# EAGLE schematic MUA08A.pac (EAGLE 7.5.0)

## Sheet 1 of 4: 0.8-14V to 5V converter
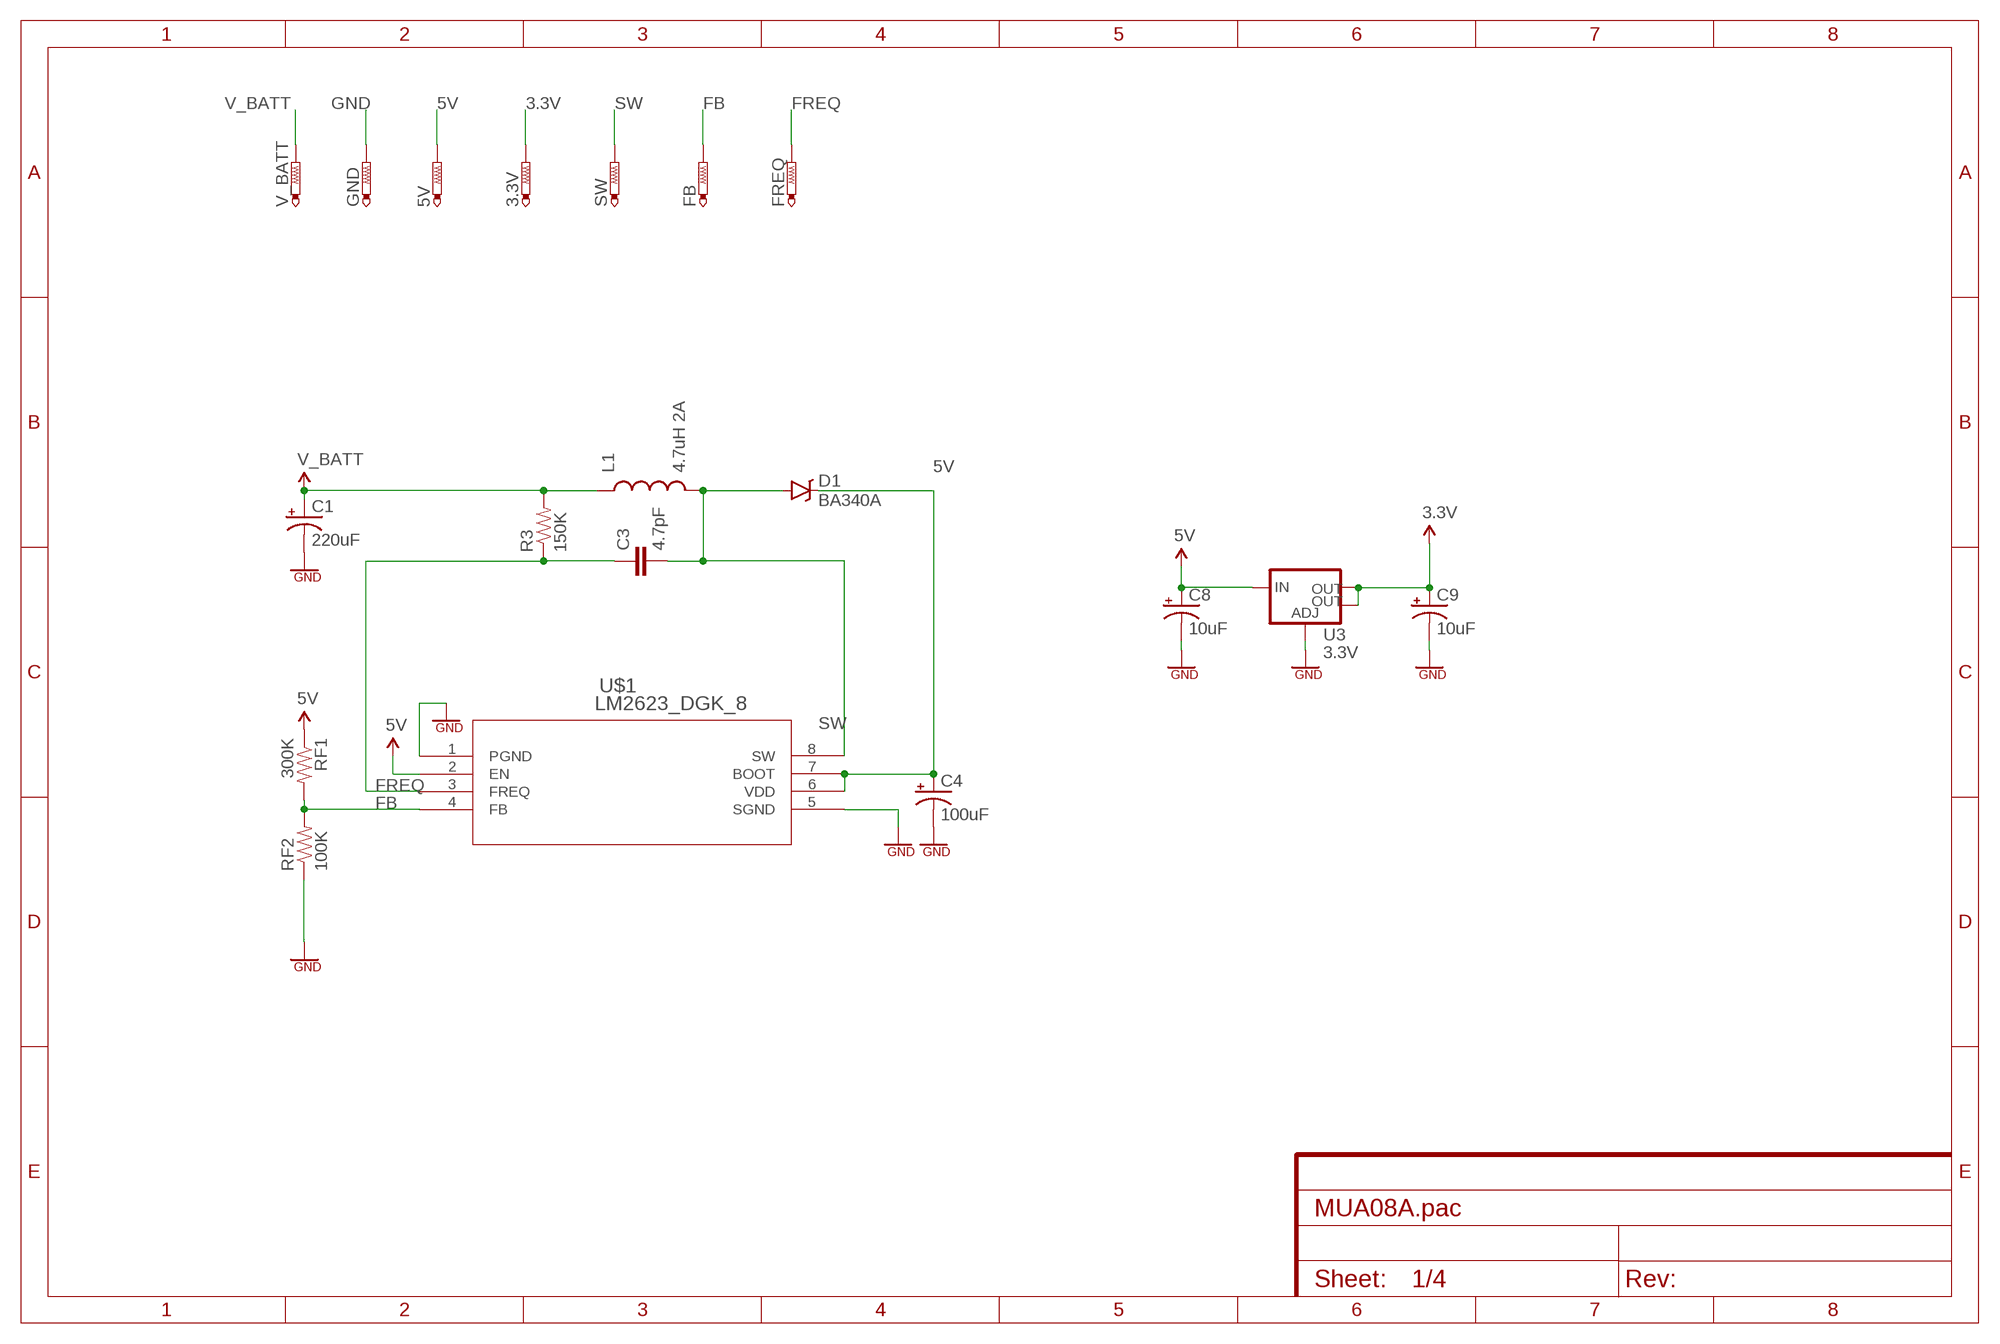
[diagram p0: schematic, sheet 1]
FRAME1 (FRAME-A4L): CNAME: Christmas Decoration Prototype; CREVISION: 0.1

### Parts
3.3V  PTR1PAD1-13  [P1-13]
5V  PTR1PAD1-13  [P1-13]
C1  220uF  CAP_POL1206-KIT  [EIA3216-KIT]
C3  4.7pF  CAP0603-CAP  [0603-CAP]
C4  100uF  CPOL-USB/3528-21R  [B/3528-21R]
C8  10uF  CAP_POL1206  [EIA3216]
C9  10uF  CAP_POL1206  [EIA3216]
D1  BA340A  B340A  [SMA-DIODE]
FB  PTR1PAD1-13  [P1-13]
FREQ  PTR1PAD1-13  [P1-13]
GND  PTR1PAD1-13  [P1-13]
L1  4.7uH 2A  INDUCTORCR54-KIT  [CR54-KIT]
R3  150K  RESISTOR0603-RES  [0603-RES]
RF1  300K  RESISTOR0603-RES  [0603-RES]
RF2  100K  RESISTOR0603-RES  [0603-RES]
SW  PTR1PAD1-13  [P1-13]
U3  3.3V  V_REG_LM1117SOT223  [SOT223]
U$1  LM2623_DGK_8  [MUA08A]
V_BATT  PTR1PAD1-13  [P1-13]

### Nets
3.3V: 3.3V.TP C9.A(+) U3.2(OUT) U3.4(OUT) ; also sheet 4
5V [POWER]: 5V.TP C4.+ C8.A(+) D1.C RF1.1 U3.3(IN) U$1.2(EN) U$1.6(VDD) U$1.7(BOOT) ; also sheet 2,3,4
FB: FB.TP RF1.2 RF2.2 U$1.4(FB)
FREQ: C3.1 FREQ.TP R3.1 U$1.3(FREQ)
GND [POWER]: C1.C(-) C4.- C8.C(-) C9.C(-) GND.TP RF2.1 U3.1(ADJ) U$1.1(PGND) U$1.5(SGND) ; also sheet 2,3,4
SW [POWER]: C3.2 D1.A L1.P$2 SW.TP U$1.8(SW)
V_BATT [POWER]: C1.A(+) L1.P$1 R3.2 V_BATT.TP

## Sheet 2 of 4: APA102-5050 RGB LED Chain
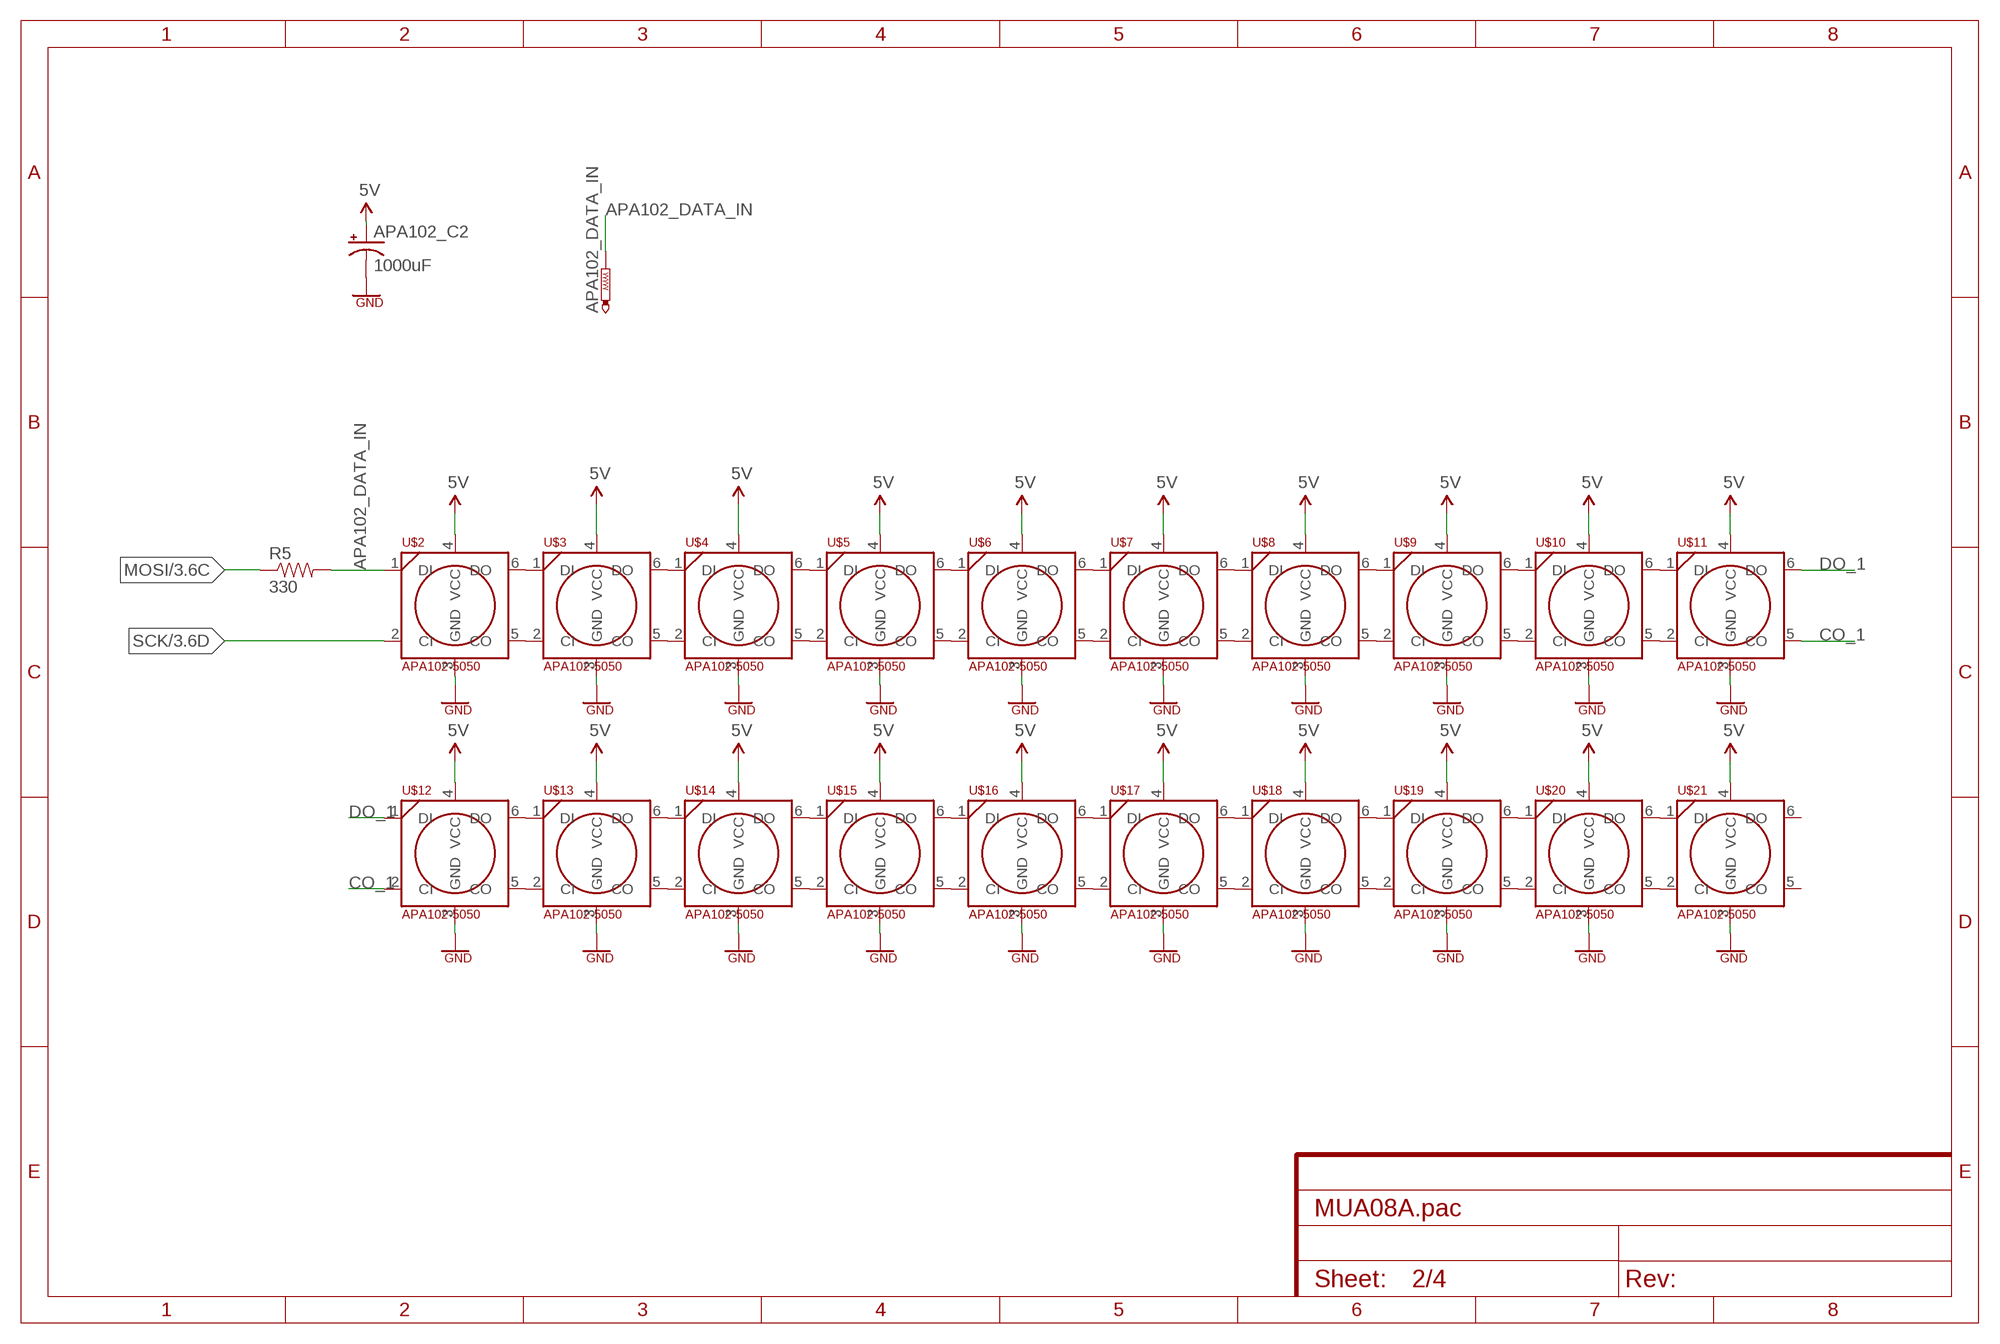
[diagram p1: schematic, sheet 2]
FRAME2 (FRAME-A4L): CNAME: APA102C RGB LEDs

### Parts
APA102_C2  1000uF  CPOL-USD/7343-31W  [D/7343-31W]
APA102_DATA_IN  PTR1PAD1-13  [P1-13]
R5  330  RESISTOR0603-RES  [0603-RES]
U$2  APA102-5050  [5050]
U$3  APA102-5050  [5050]
U$4  APA102-5050  [5050]
U$5  APA102-5050  [5050]
U$6  APA102-5050  [5050]
U$7  APA102-5050  [5050]
U$8  APA102-5050  [5050]
U$9  APA102-5050  [5050]
U$10  APA102-5050  [5050]
U$11  APA102-5050  [5050]
U$12  APA102-5050  [5050]
U$13  APA102-5050  [5050]
U$14  APA102-5050  [5050]
U$15  APA102-5050  [5050]
U$16  APA102-5050  [5050]
U$17  APA102-5050  [5050]
U$18  APA102-5050  [5050]
U$19  APA102-5050  [5050]
U$20  APA102-5050  [5050]
U$21  APA102-5050  [5050]

### Nets
5V [POWER]: APA102_C2.+ U$2.4(VCC) U$3.4(VCC) U$4.4(VCC) U$5.4(VCC) U$6.4(VCC) U$7.4(VCC) U$8.4(VCC) U$9.4(VCC) U$10.4(VCC) U$11.4(VCC) U$12.4(VCC) U$13.4(VCC) U$14.4(VCC) U$15.4(VCC) U$16.4(VCC) U$17.4(VCC) U$18.4(VCC) U$19.4(VCC) U$20.4(VCC) U$21.4(VCC) ; also sheet 1,3,4
APA102_DATA_IN: APA102_DATA_IN.TP R5.2 U$2.1(DI)
CO_1: U$11.5(CO) U$12.2(CI)
DO_1: U$11.6(DO) U$12.1(DI)
GND [POWER]: APA102_C2.- U$2.3(GND) U$3.3(GND) U$4.3(GND) U$5.3(GND) U$6.3(GND) U$7.3(GND) U$8.3(GND) U$9.3(GND) U$10.3(GND) U$11.3(GND) U$12.3(GND) U$13.3(GND) U$14.3(GND) U$15.3(GND) U$16.3(GND) U$17.3(GND) U$18.3(GND) U$19.3(GND) U$20.3(GND) U$21.3(GND) ; also sheet 1,3,4
MOSI: R5.1 ; also sheet 3
N$2: U$2.6(DO) U$3.1(DI)
N$3: U$2.5(CO) U$3.2(CI)
N$4: U$3.6(DO) U$4.1(DI)
N$5: U$3.5(CO) U$4.2(CI)
N$6: U$4.6(DO) U$5.1(DI)
N$7: U$4.5(CO) U$5.2(CI)
N$8: U$5.6(DO) U$6.1(DI)
N$9: U$5.5(CO) U$6.2(CI)
N$10: U$6.6(DO) U$7.1(DI)
N$11: U$6.5(CO) U$7.2(CI)
N$12: U$7.6(DO) U$8.1(DI)
N$13: U$7.5(CO) U$8.2(CI)
N$14: U$8.6(DO) U$9.1(DI)
N$15: U$8.5(CO) U$9.2(CI)
N$16: U$9.6(DO) U$10.1(DI)
N$17: U$9.5(CO) U$10.2(CI)
N$18: U$10.6(DO) U$11.1(DI)
N$19: U$10.5(CO) U$11.2(CI)
N$20: U$12.6(DO) U$13.1(DI)
N$21: U$12.5(CO) U$13.2(CI)
N$22: U$13.6(DO) U$14.1(DI)
N$23: U$13.5(CO) U$14.2(CI)
N$24: U$14.6(DO) U$15.1(DI)
N$25: U$14.5(CO) U$15.2(CI)
N$26: U$15.6(DO) U$16.1(DI)
N$27: U$15.5(CO) U$16.2(CI)
N$28: U$16.6(DO) U$17.1(DI)
N$29: U$16.5(CO) U$17.2(CI)
N$30: U$17.6(DO) U$18.1(DI)
N$31: U$17.5(CO) U$18.2(CI)
N$32: U$18.6(DO) U$19.1(DI)
N$33: U$18.5(CO) U$19.2(CI)
N$34: U$19.6(DO) U$20.1(DI)
N$35: U$19.5(CO) U$20.2(CI)
N$36: U$20.6(DO) U$21.1(DI)
N$37: U$20.5(CO) U$21.2(CI)
SCK: U$2.2(CI) ; also sheet 3
Unconnected: U$21.5(CO) U$21.6(DO)

## Sheet 3 of 4: ATMEGA328P-U
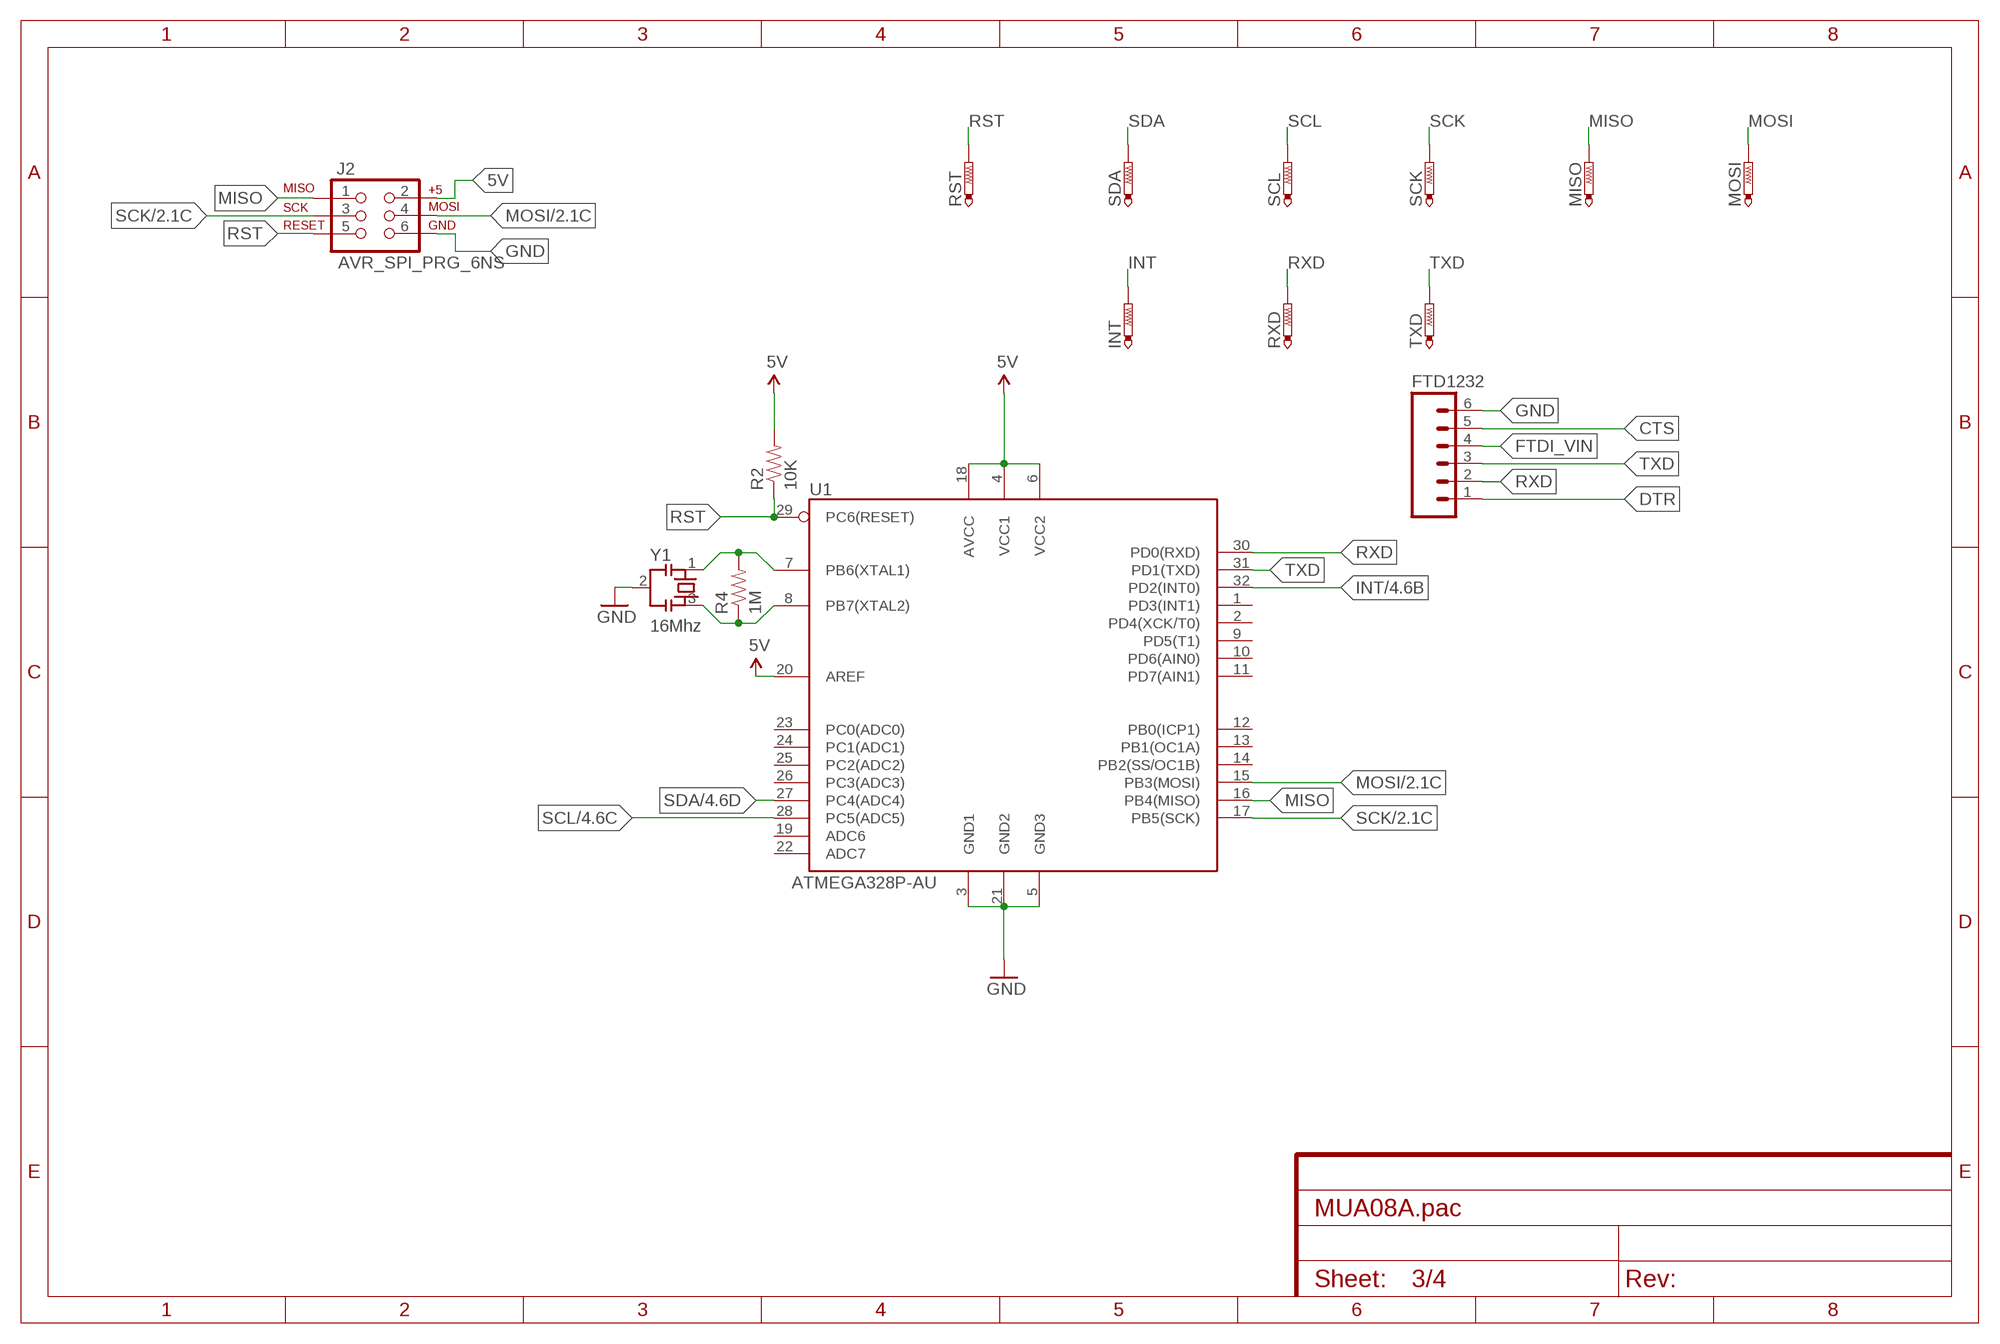
[diagram p2: schematic, sheet 3]
FRAME3 (FRAME-A4L): CNAME: ATMEGA328P-U

### Parts
FTD1232  M06FEMALE_LOCK  [1X06_FEMALE_LOCK.010]
INT  PTR1PAD1-13  [P1-13]
J2  AVR_SPI_PRG_6NS  [2X3-NS]
MISO  PTR1PAD1-13  [P1-13]
MOSI  PTR1PAD1-13  [P1-13]
R2  10K  RESISTOR0603  [0603-RES]
R4  1M  RESISTOR0603  [0603-RES]
RST  PTR1PAD1-13  [P1-13]
RXD  PTR1PAD1-13  [P1-13]
SCK  PTR1PAD1-13  [P1-13]
SCL  PTR1PAD1-13  [P1-13]
SDA  PTR1PAD1-13  [P1-13]
TXD  PTR1PAD1-13  [P1-13]
U1  ATMEGA328P-AU  [TQFP32]
Y1  16Mhz  CSTCE  [CSTCE]

### Nets
5V [POWER]: J2.2 R2.2 U1.4(VCC1) U1.6(VCC2) U1.18(AVCC) U1.20(AREF) ; also sheet 1,2,4
CTS: FTD1232.5
DTR: FTD1232.1
FTDI_VIN: FTD1232.4
GND [POWER]: FTD1232.6 J2.6 U1.3(GND1) U1.5(GND3) U1.21(GND2) Y1.2 ; also sheet 1,2,4
INT: INT.TP U1.32(PD2(INT0)) ; also sheet 4
MISO: J2.1 MISO.TP U1.16(PB4(MISO))
MOSI: J2.4 MOSI.TP U1.15(PB3(MOSI)) ; also sheet 2
N$38: R4.2 U1.7(PB6(XTAL1)) Y1.1
N$39: R4.1 U1.8(PB7(XTAL2)) Y1.3
RST: J2.5 R2.1 RST.TP U1.29(PC6(RESET))
RXD: FTD1232.2 RXD.TP U1.30(PD0(RXD))
SCK: J2.3 SCK.TP U1.17(PB5(SCK)) ; also sheet 2
SCL: SCL.TP U1.28(PC5(ADC5)) ; also sheet 4
SDA: SDA.TP U1.27(PC4(ADC4)) ; also sheet 4
TXD: FTD1232.3 TXD.TP U1.31(PD1(TXD))
Unconnected: U1.1(PD3(INT1)) U1.2(PD4(XCK/T0)) U1.9(PD5(T1)) U1.10(PD6(AIN0)) U1.11(PD7(AIN1)) U1.12(PB0(ICP1)) U1.13(PB1(OC1A)) U1.14(PB2(SS/OC1B)) U1.19(ADC6) U1.22(ADC7) U1.23(PC0(ADC0)) U1.24(PC1(ADC1)) U1.25(PC2(ADC2)) U1.26(PC3(ADC3))

## Sheet 4 of 4
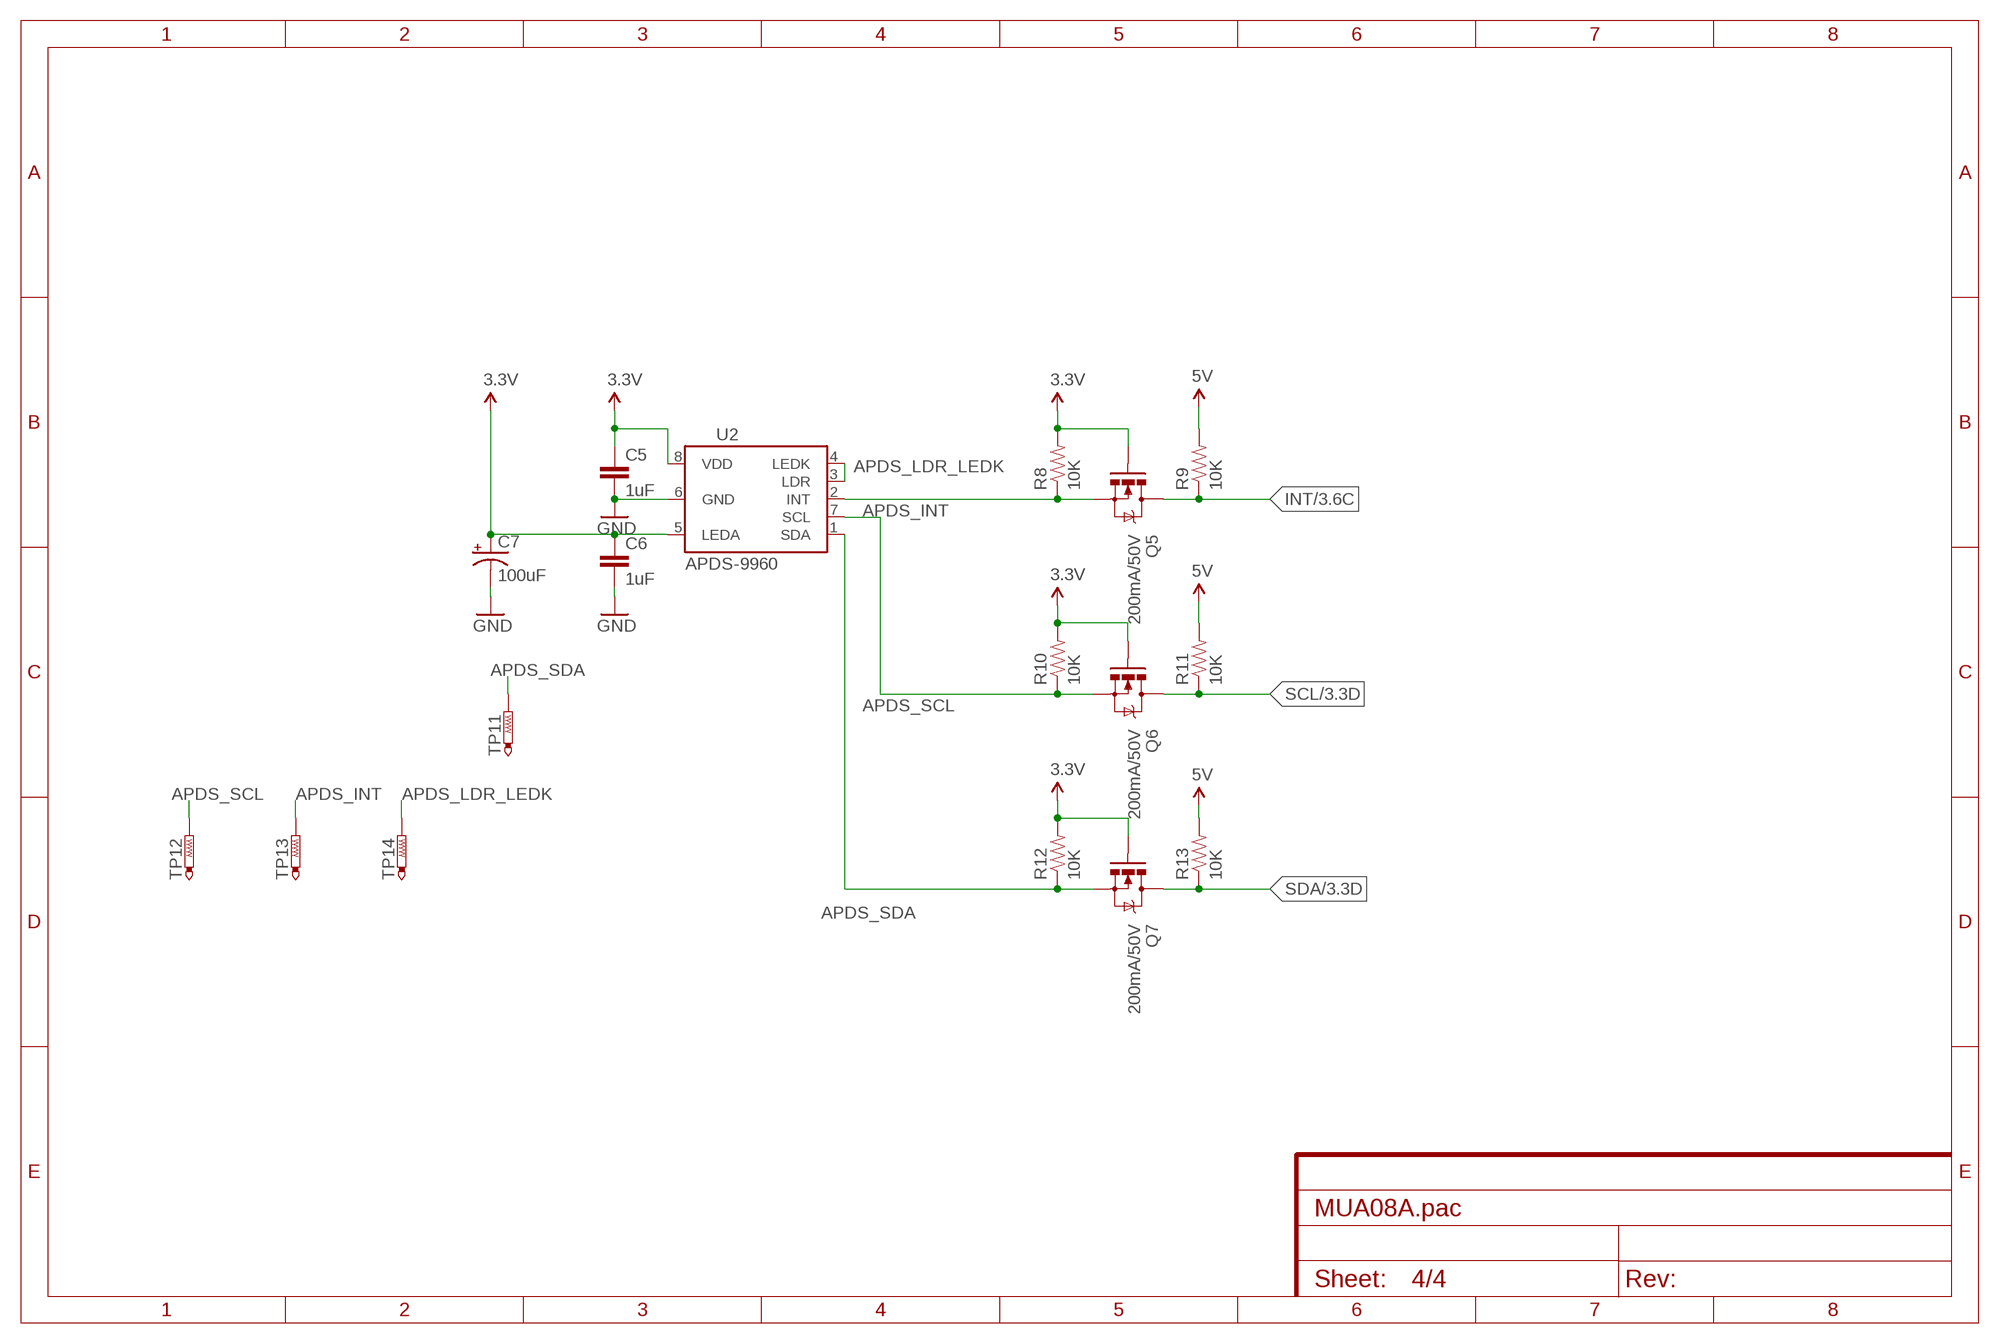
[diagram p3: schematic, sheet 4]
FRAME4 (FRAME-A4L): CNAME: APDS9960 & I2C Level Shifters

### Parts
C5  1uF  CAP0603-CAP  [0603-CAP]
C6  1uF  CAP0603-CAP  [0603-CAP]
C7  100uF  CAP_POL1206-KIT  [EIA3216-KIT]
Q5  200mA/50V  MOSFET-NCHANNELBSS138  [SOT23-3]
Q6  200mA/50V  MOSFET-NCHANNELBSS138  [SOT23-3]
Q7  200mA/50V  MOSFET-NCHANNELBSS138  [SOT23-3]
R8  10K  RESISTOR0603  [0603-RES]
R9  10K  RESISTOR0603  [0603-RES]
R10  10K  RESISTOR0603  [0603-RES]
R11  10K  RESISTOR0603  [0603-RES]
R12  10K  RESISTOR0603  [0603-RES]
R13  10K  RESISTOR0603  [0603-RES]
TP11  PTR1PAD1-13  [P1-13]
TP12  PTR1PAD1-13  [P1-13]
TP13  PTR1PAD1-13  [P1-13]
TP14  PTR1PAD1-13  [P1-13]
U2  APDS-9960  [APDS-9960]

### Nets
3.3V: C5.1 C6.1 C7.A(+) Q5.1(G) Q6.1(G) Q7.1(G) R8.2 R10.2 R12.2 U2.5(LEDA) U2.8(VDD) ; also sheet 1
5V [POWER]: R9.2 R11.2 R13.2 ; also sheet 1,2,3
APDS_INT: Q5.2(S) R8.1 TP13.TP U2.2(INT)
APDS_LDR_LEDK: TP14.TP U2.3(LDR) U2.4(LEDK)
APDS_SCL: Q6.2(S) R10.1 TP12.TP U2.7(SCL)
APDS_SDA: Q7.2(S) R12.1 TP11.TP U2.1(SDA)
GND [POWER]: C5.2 C6.2 C7.C(-) U2.6(GND) ; also sheet 1,2,3
INT: Q5.3(D) R9.1 ; also sheet 3
SCL: Q6.3(D) R11.1 ; also sheet 3
SDA: Q7.3(D) R13.1 ; also sheet 3

## Library data of the parts
3.3V 5V APA102_DATA_IN FB FREQ GND INT MISO MOSI RST RXD SCK SCL SDA SW TP11-TP14 TXD V_BATT = testpad:PTR1: TEST PIN
APA102_C2 = resistor:CPOL-US: POLARIZED CAPACITOR, American symbol
C1 C7-C9 = SparkFun-Capacitors:CAP_POL: Capacitor Polarized These are standard SMD and PTH capacitors. Normally 10uF, 47uF, and 100uF in electrolytic and tantalum varieties. Always verify the external diameter of the through hole cap, it varies with capacity, voltage, and manufacturer. The EIA devices should be standard.
C3 = SparkFun-Capacitors:CAP: Capacitor Standard 0603 ceramic capacitor, and 0.1" leaded capacitor.
C4 = rcl:CPOL-US: POLARIZED CAPACITOR, American symbol
C5 C6 = SparkFun-Passives:CAP: Capacitor Standard 0603 ceramic capacitor, and 0.1" leaded capacitor.
D1 = SparkFun-DiscreteSemi:B340A: Schottky Diode 3A-40V; PROD_ID: DIO-09886
FTD1232 = SparkFun-Connectors:M06: Header 6 Standard 6-pin 0.1" header. Use with straight break away headers (SKU : PRT-00116), right angle break away headers (PRT-00553), swiss pins (PRT-00743), machine pins (PRT-00117), and female headers (PRT-00115). Molex polarized connector foot print use with SKU : PRT-08094 with associated crimp pins and housings. NOTES ON THE VARIANTS LOCK and LOCK_LONGPADS... This footprint was designed to help hold the alignment of a through-hole component (i.e. 6-pin header) while soldering it into place. You may notice that each hole has been shifted either up or down by 0.005 of an inch from it's more standard position (which is a perfectly straight line). This slight alteration caused the pins (the squares in the middle) to touch the edges of the holes. Because they are alternating, it causes a "brace" to hold the component in place. 0.005 has proven to be the perfect amount of "off-center" position when using our standard breakaway headers. Although looks a little odd when you look at the bare footprint, once you have a header in there, the alteration is very hard to notice. Also,if you push a header all the way into place, it is covered up entirely on the bottom side. This idea of altering the position of holes to aid alignment will be further integrated into the Sparkfun Library for other footprints. It can help hold any component with 3 or more connection pins.
J2 = SparkFun-Connectors:AVR_SPI_PRG_6: AVR ISP 6 Pin This is the reduced ISP connector for AVR programming. Common on Arduino. This footprint will take up less PCB space and can be used with a 10-pin to 6-pin adapter such as SKU: BOB-08508 **Special note about "TEST_POINT" package. The stop mask is on the top side, so if you want your programming test points to be on the bottom of your board, make sure to place this package on the bottom side of the board. This also ensure that the orientation to program from the bottom side will be correct.
L1 = SparkFun-Passives:INDUCTOR: Inductors Basic Inductor/Choke - 0603 and 1206. Footprints are not proven and vary greatly between part numbers. INDUCTOR POWER 3.3UH 4.0A SMD 0.197" L x 0.197" W x 0.177" H (5.00mm x 5.00mm x 4.50mm)
Q5-Q7 = SparkFun-DiscreteSemi:MOSFET-NCHANNEL: Common NMOSFET Parts MFG P/N Store ID Prod ID FDD8780 TRANS-09984 SI7820DN TRANS-11055 FDS6630A IC-08089 2N7002PW TRANS-11151 FQP30N06L COM-10213 TRANS-10060 BSS123LT1G TRANS-08345 BSS138 TRANS-00830 BS170 2N7000; PROD_ID: TRANS-00830
R2 R4 R8-R13 = SparkFun-Resistors:RESISTOR: Resistor Basic schematic elements and footprints for 0603, 1206, and PTH resistors.
R3 R5 RF1 RF2 = SparkFun-Passives:RESISTOR: Resistor Basic schematic elements and footprints for 0603, 1206, and PTH resistors.
U1 = eagle-book:ATMEGA328P: Atmel 32-pin 8-bit microcontroller
U2 = SparkFun-Sensors:APDS-9960: Avago APDS-9960 digital proximity, ambient light, RGB, and gesture sensor.; PROD_ID: SEN-12005
U3 = SparkFun-PowerIC:V_REG_LM1117: Voltage Regulator LM1117 Standard adjustable voltage regulator but in SMD form. Spark Fun Electronics SKU : COM-00595; PROD_ID: VREG-08170
U$1 = lm2623:LM2623_DGK_8; MANUFACTURER_PART_NUMBER: lm2623ammnopb; VENDOR: National
U$2-U$21 = APA102:APA102-5050: APA102 RGB LED in 5050 package
Y1 = eagle-book:CSTCE: SMD resonator from Murata (CSTCE16M0V53-S0)